# Altium schematic sheet Power.SchDoc: {Наименование}
size 420 x 297 mm; ApprovedBy: {Утвердил}; CheckedBy: {Проверил}; DrawnBy: {Разраб.}; DocumentNumber: НРДЦ.ХХХХХХ.ХХХ 00; SheetNumber: {}; SheetTotal: {}; Scale: {Мш.}; PageSetup: Record=PageOptions|CenterHorizontal=False|CenterVertical=False|PrintScale=0.95|XCorrection=0.00|YCorrection=0.00|PrintKind=1|BorderSize=5000000|LeftOffset=0|BottomOffset=0|Orientation=1|PaperLength=1000|PaperWidth=1000|Scale=100|PaperSource=15|PrintQuality=600|MediaType=1|DitherType=10|PaperKind=A4|PrintScaleMode=1; ProcessInspection: {Т.контр.}; Mass: {М.}; NormInspection: {Н.контр.}; Letter1Column: {}; Letter2Column: {}; Letter3Column: {}; DocumentType: {Документ}; Rule: PcbType=ProtelPcb
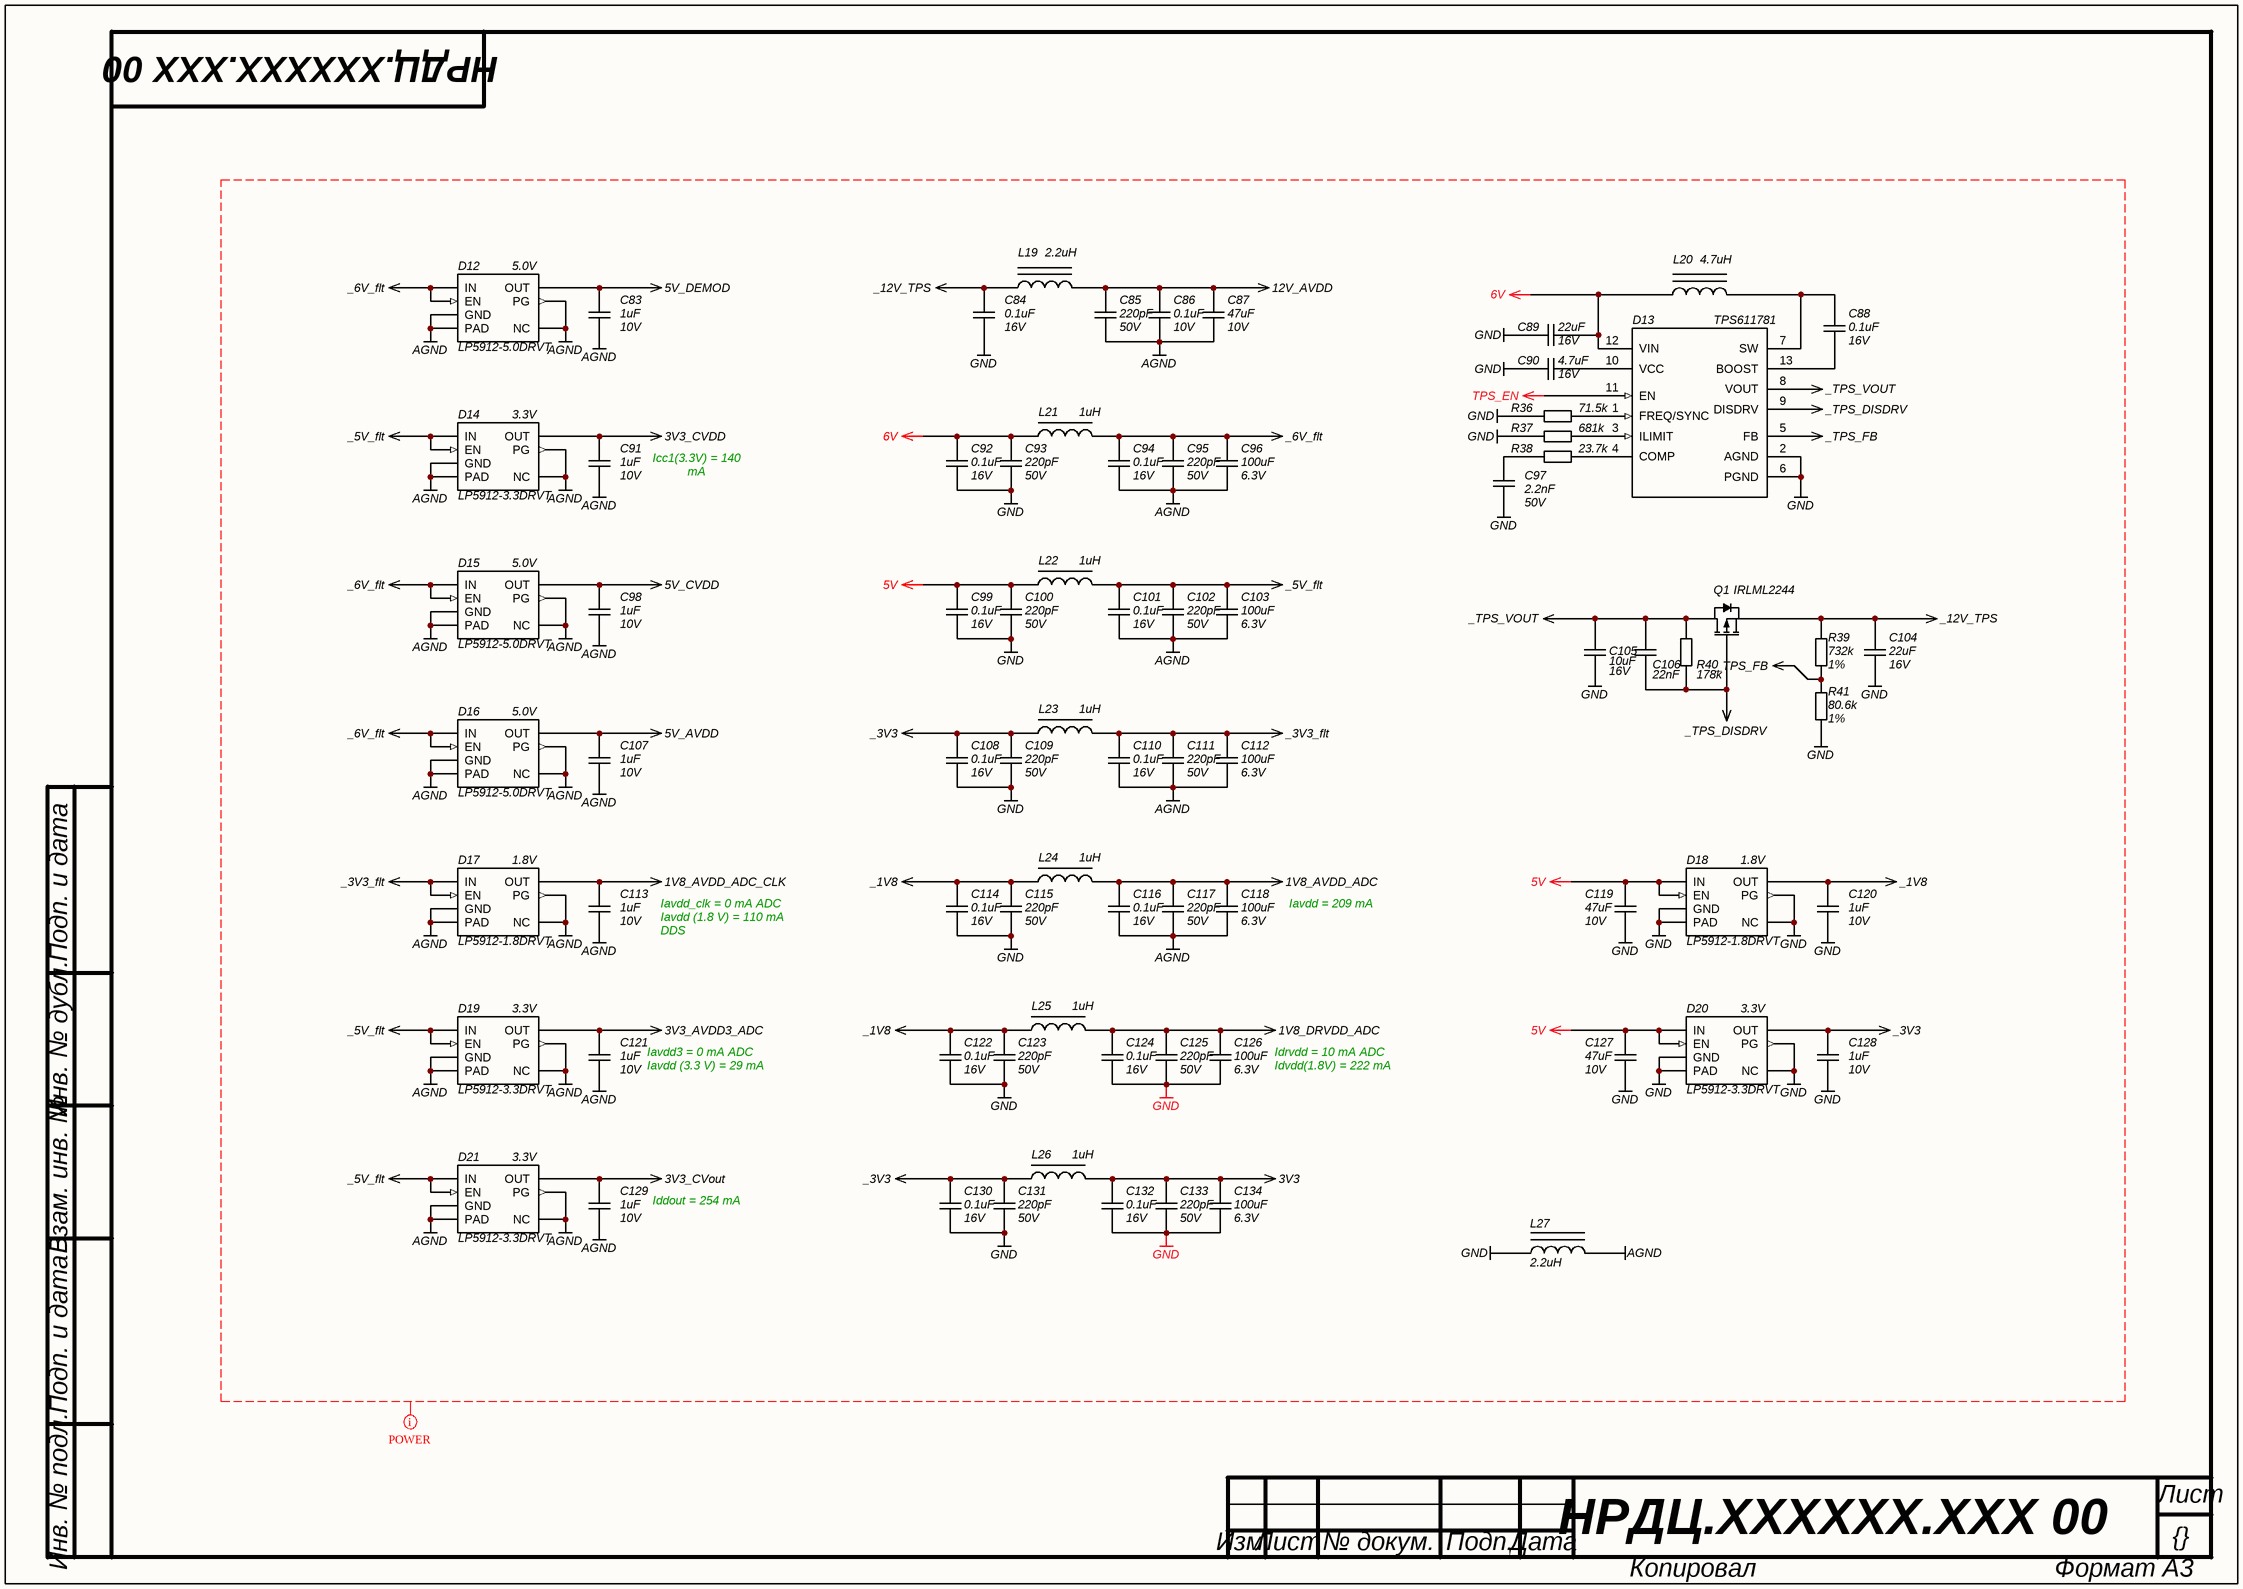
[diagram p0: Power.SchDoc]

## Parts
C83  value 1uF  Voltage: 10V  [C0805]  (hidden comment: CAP)
C84  value 0.1uF  Voltage: 16V  [C0402]  (hidden comment: CAP)
C85  value 220pF  Voltage: 50V  [C0603]  (hidden comment: CAP)
C86  value 0.1uF  Voltage: 10V  [C0402]  (hidden comment: CAP)
C87  value 47uF  Voltage: 10V  [C1210]  (hidden comment: CAP uF)
C88  value 0.1uF  Voltage: 16V  [C0402]  (hidden comment: CAP)
C89  value 22uF  Voltage: 16V  [C0805]  (hidden comment: CAP uF)
C90  value 4.7uF  Voltage: 16V  [C0603]  (hidden comment: CAP)
C91  value 1uF  Voltage: 10V  [C0805]  (hidden comment: CAP)
C92  value 0.1uF  Voltage: 16V  [C0603]  (hidden comment: CAP)
C93  value 220pF  Voltage: 50V  [C0603]  (hidden comment: CAP)
C94  value 0.1uF  Voltage: 16V  [C0603]  (hidden comment: CAP)
C95  value 220pF  Voltage: 50V  [C0603]  (hidden comment: CAP)
C96  value 100uF  Voltage: 6.3V  [C1210]  (hidden comment: CAP uF)
C97  value 2.2nF  Voltage: 50V  [C0603]  (hidden comment: CAP)
C98  value 1uF  Voltage: 10V  [C0805]  (hidden comment: CAP)
C99  value 0.1uF  Voltage: 16V  [C0603]  (hidden comment: CAP)
C100  value 220pF  Voltage: 50V  [C0603]  (hidden comment: CAP)
C101  value 0.1uF  Voltage: 16V  [C0603]  (hidden comment: CAP)
C102  value 220pF  Voltage: 50V  [C0603]  (hidden comment: CAP)
C103  value 100uF  Voltage: 6.3V  [C1210]  (hidden comment: CAP uF)
C104  value 22uF  Voltage: 16V  [C0805]  (hidden comment: CAP uF)
C105  value 10uF  Voltage: 16V  [C0805]  (hidden comment: CAP uF)
C106  value 22nF  [C0402]  (hidden comment: CAP)
C107  value 1uF  Voltage: 10V  [C0805]  (hidden comment: CAP)
C108  value 0.1uF  Voltage: 16V  [C0603]  (hidden comment: CAP)
C109  value 220pF  Voltage: 50V  [C0603]  (hidden comment: CAP)
C110  value 0.1uF  Voltage: 16V  [C0603]  (hidden comment: CAP)
C111  value 220pF  Voltage: 50V  [C0603]  (hidden comment: CAP)
C112  value 100uF  Voltage: 6.3V  [C1210]  (hidden comment: CAP uF)
C113  value 1uF  Voltage: 10V  [C0805]  (hidden comment: CAP)
C114  value 0.1uF  Voltage: 16V  [C0603]  (hidden comment: CAP)
C115  value 220pF  Voltage: 50V  [C0603]  (hidden comment: CAP)
C116  value 0.1uF  Voltage: 16V  [C0603]  (hidden comment: CAP)
C117  value 220pF  Voltage: 50V  [C0603]  (hidden comment: CAP)
C118  value 100uF  Voltage: 6.3V  [C1210]  (hidden comment: CAP uF)
C119  value 47uF  Voltage: 10V  [C1210]  (hidden comment: CAP uF)
C120  value 1uF  Voltage: 10V  [C0805]  (hidden comment: CAP)
C121  value 1uF  Voltage: 10V  [C0805]  (hidden comment: CAP)
C122  value 0.1uF  Voltage: 16V  [C0603]  (hidden comment: CAP)
C123  value 220pF  Voltage: 50V  [C0603]  (hidden comment: CAP)
C124  value 0.1uF  Voltage: 16V  [C0603]  (hidden comment: CAP)
C125  value 220pF  Voltage: 50V  [C0603]  (hidden comment: CAP)
C126  value 100uF  Voltage: 6.3V  [C1210]  (hidden comment: CAP uF)
C127  value 47uF  Voltage: 10V  [C1210]  (hidden comment: CAP uF)
C128  value 1uF  Voltage: 10V  [C0805]  (hidden comment: CAP)
C129  value 1uF  Voltage: 10V  [C0805]  (hidden comment: CAP)
C130  value 0.1uF  Voltage: 16V  [C0603]  (hidden comment: CAP)
C131  value 220pF  Voltage: 50V  [C0603]  (hidden comment: CAP)
C132  value 0.1uF  Voltage: 16V  [C0603]  (hidden comment: CAP)
C133  value 220pF  Voltage: 50V  [C0603]  (hidden comment: CAP)
C134  value 100uF  Voltage: 6.3V  [C1210]  (hidden comment: CAP uF)
D12  Name: LP5912-5.0DRVT  Voltage: 5.0V  [WSON-6]  (hidden comment: LP5912)
D13  TPS611781  [TPS611781x]
D14  Name: LP5912-3.3DRVT  Voltage: 3.3V  [WSON-6]  (hidden comment: LP5912)
D15  Name: LP5912-5.0DRVT  Voltage: 5.0V  [WSON-6]  (hidden comment: LP5912)
D16  Name: LP5912-5.0DRVT  Voltage: 5.0V  [WSON-6]  (hidden comment: LP5912)
D17  Name: LP5912-1.8DRVT  Voltage: 1.8V  [WSON-6]  (hidden comment: LP5912)
D18  Name: LP5912-1.8DRVT  Voltage: 1.8V  [WSON-6]  (hidden comment: LP5912)
D19  Name: LP5912-3.3DRVT  Voltage: 3.3V  [WSON-6]  (hidden comment: LP5912)
D20  Name: LP5912-3.3DRVT  Voltage: 3.3V  [WSON-6]  (hidden comment: LP5912)
D21  Name: LP5912-3.3DRVT  Voltage: 3.3V  [WSON-6]  (hidden comment: LP5912)
L19  value 2.2uH  [XAL4020]  (hidden comment: Inductor PWR)
L20  value 4.7uH  [XAL4030]  (hidden comment: Inductor PWR)
L21  value 1uH  [L1210_Murata LQH]  (hidden comment: Inductor LF)
L22  value 1uH  [L1210_Murata LQH]  (hidden comment: Inductor LF)
L23  value 1uH  [L1210_Murata LQH]  (hidden comment: Inductor LF)
L24  value 1uH  [L1210_Murata LQH]  (hidden comment: Inductor LF)
L25  value 1uH  [L1210_Murata LQH]  (hidden comment: Inductor LF)
L26  value 1uH  [L1210_Murata LQH]  (hidden comment: Inductor LF)
L27  value 2.2uH  [XAL4020]  (hidden comment: Inductor PWR)
Q1  IRLML2244  [SOT-23]
R36  value 71.5k  [R0402]  (hidden comment: RES)
R37  value 681k  [R0402]  (hidden comment: RES)
R38  value 23.7k  [R0603]  (hidden comment: RES)
R39  value 732k  Tolerance: 1%  [R0402]  (hidden comment: RES)
R40  value 178k  [R0402]  (hidden comment: RES)
R41  value 80.6k  Tolerance: 1%  [R0402]  (hidden comment: RES)

## Nets
1V8_AVDD_ADC: C116.2 C117.2 C118.2 L24.2
1V8_AVDD_ADC_CLK: C113.1 D17.1(OUT)
1V8_DRVDD_ADC: C124.2 C125.2 C126.2 L25.2
3V3: C132.2 C133.2 C134.2 L26.2
3V3_AVDD3_ADC: C121.1 D19.1(OUT)
3V3_CVDD: C91.1 D14.1(OUT)
3V3_CVout: C129.1 D21.1(OUT)
5V: C99.2 C100.2 C119.2 C127.2 D18.4(EN) D18.6(IN) D20.4(EN) D20.6(IN) L22.1
5V_AVDD: C107.1 D16.1(OUT)
5V_CVDD: C98.1 D15.1(OUT)
5V_DEMOD: C83.1 D12.1(OUT)
6V: C89.1 C92.2 C93.2 D13.12(VIN) L20.1 L21.1
12V_AVDD: C85.2 C86.2 C87.2 L19.2
_1V8: C114.2 C115.2 C120.1 C122.2 C123.2 D18.1(OUT) L24.1 L25.1
_3V3: C108.2 C109.2 C128.1 C130.2 C131.2 D20.1(OUT) L23.1 L26.1
_3V3_flt: C110.2 C111.2 C112.2 D17.4(EN) D17.6(IN) L23.2
_5V_flt: C101.2 C102.2 C103.2 D14.4(EN) D14.6(IN) D19.4(EN) D19.6(IN) D21.4(EN) D21.6(IN) L22.2
_6V_flt: C94.2 C95.2 C96.2 D12.4(EN) D12.6(IN) D15.4(EN) D15.6(IN) D16.4(EN) D16.6(IN) L21.2
_12V_TPS: C84.2 C104.2 L19.1 Q1.2(S) R39.2
_TPS_DISDRV: C106.2 D13.9(DISDRV) Q1.1(G) R40.1
_TPS_FB: D13.5(FB) R39.1 R41.2
_TPS_VOUT: C105.2 C106.1 D13.8(VOUT) Q1.3(D) R40.2
AGND: C83.2 C85.1 C86.1 C87.1 C91.2 C94.1 C95.1 C96.1 C98.2 C101.1 C102.1 C103.1 C107.2 C110.1 C111.1 C112.1 C113.2 C116.1 C117.1 C118.1 C121.2 C129.2 D12.0(PAD) D12.2(NC) D12.3(PG) D12.5(GND) D14.0(PAD) D14.2(NC) D14.3(PG) D14.5(GND) D15.0(PAD) D15.2(NC) D15.3(PG) D15.5(GND) D16.0(PAD) D16.2(NC) D16.3(PG) D16.5(GND) D17.0(PAD) D17.2(NC) D17.3(PG) D17.5(GND) D19.0(PAD) D19.2(NC) D19.3(PG) D19.5(GND) D21.0(PAD) D21.2(NC) D21.3(PG) D21.5(GND) L27.2
GND: C84.1 C89.2 C90.2 C92.1 C93.1 C97.1 C99.1 C100.1 C104.1 C105.1 C108.1 C109.1 C114.1 C115.1 C119.1 C120.2 C122.1 C123.1 C124.1 C125.1 C126.1 C127.1 C128.2 C130.1 C131.1 C132.1 C133.1 C134.1 D13.2(AGND) D13.6(PGND) D18.0(PAD) D18.2(NC) D18.3(PG) D18.5(GND) D20.0(PAD) D20.2(NC) D20.3(PG) D20.5(GND) L27.1 R36.1 R37.1 R41.1
TPS_EN: D13.11(EN)
NetC88_1: C88.1 D13.13(BOOST)
NetC88_2: C88.2 D13.7(SW) L20.2
NetC90_1: C90.1 D13.10(VCC)
NetC97_2: C97.2 R38.1
NetD13_1: D13.1(FREQ/SYNC) R36.2
NetD13_3: D13.3(ILIMIT) R37.2
NetD13_4: D13.4(COMP) R38.2

## Layout directives
net class POWER: 1V8_AVDD_ADC, 1V8_AVDD_ADC_CLK, 1V8_DRVDD_ADC, 3V3, 3V3_AVDD3_ADC, 3V3_CVDD, 3V3_CVout, 5V, 5V_AVDD, 5V_CVDD, 5V_DEMOD, 6V, 12V_AVDD, _1V8, _3V3, _3V3_flt, _5V_flt, _6V_flt, _12V_TPS, _TPS_DISDRV, _TPS_FB, _TPS_VOUT, AGND, GND, TPS_EN

## Notes on the sheet
- (near C91) Icc1(3.3V) = 140 mA
  Icc2(3.3V) = 130 mA
- Iavdd_clk = 0 mA ADC
  Iavdd (1.8 V) = 110 mA DDS
- Iavdd = 209 mA ADC
- (near C121) Iavdd3 = 0 mA ADC
  Iavdd (3.3 V) = 29 mA DDS
- Idrvdd = 10 mA ADC
  Idvdd(1.8V) = 222 mA DDS
- (near C129) Iddout = 254 mA
- Подп. и дата
- Инв. № дубл.
- Взам. инв. №
- Инв. № подл.
- Лист
- Изм.
- № докум.
- Подп.
- Дата
- Копировал
- Формат А3

## Library data of the parts
C83 C91 C98 C107 C113 C120 C121 C128 C129 = CAP: SMD Capacitor; Manufacturer: Murata; Material: X7R; Tolerance: 10%; Type: Ceramic Capacitor; P/N: GRM21BR71A105KA01K
C84 C88 = CAP: SMD Capacitor; Manufacturer: Murata; Material: X5R; Tolerance: ±10%; Type: Ceramic Capacitor; P/N: GRM155R61C104KA88D
C85 C93 C95 C100 C102 C109 C111 C115 C117 C123 C125 C131 C133 = CAP: SMD Capacitor; Manufacturer: Murata; Material: X7R; Tolerance: 10%; Type: Ceramic Capacitor; P/N: GRM188R71H221KA01D
C86 = CAP: SMD Capacitor; Manufacturer: Murata; Material: X7R; Tolerance: 10%; Type: Ceramic Capacitor; P/N: GRM155R71A104KA01J
C87 C119 C127 = CAP uF: SMD Capacitor; Manufacturer: Murata; Material: X7R; Tolerance: 10%; Type: Ceramic Capacitor; P/N: GRM32ER71A476KE15L
C89 C104 = CAP uF: SMD Capacitor; Manufacturer: Murata; Material: X5R; Tolerance: ±20%; Type: Ceramic Capacitor; P/N: GRM21BR61C226ME44L
C90 = CAP: SMD Capacitor; Manufacturer: Murata; Material: X5R; Tolerance: 10%; Type: Ceramic Capacitor; P/N: GRM188R61C475KAAJD
C92 C94 C99 C101 C108 C110 C114 C116 C122 C124 C130 C132 = CAP: SMD Capacitor; Manufacturer: Murata; Material: X7R; Tolerance: 10%; Type: Ceramic Capacitor; P/N: GRM188R71C104KA01D
C96 C103 C112 C118 C126 C134 = CAP uF: SMD Capacitor; Manufacturer: Murata; Material: X5R; Tolerance: 20%; Type: Ceramic Capacitor; P/N: GRM32ER60J107ME20L
C97 = CAP: SMD Capacitor; Manufacturer: Murata; Material: NP0; Tolerance: ±5%; Type: Ceramic Capacitor; P/N: GRM1885C1H222JA01D
C105 = CAP uF: SMD Capacitor; Manufacturer: Murata; Material: X5R; Tolerance: ±10%; Type: Ceramic Capacitor; P/N: GRM21BR61C106KE15K
C106 = CAP: SMD Capacitor; Manufacturer: Murata; Material: X7R; Tolerance: 10%; Voltage: 50V; Type: Ceramic Capacitor; P/N: GCM155R71H223KA55D
D12 D14-D21 = LP5912: LP5912 500-mA Low-Noise, Low-IQ LDO; Manufacturer: Texas Instruments; Type: Low-Noise LDO; Current: 500mA; Package: WSON; Temperature Range: –40°C to 125°C
  D12 D15 D16: P/N: LP5912-5.0DRVT; Supplier 1: Arrow Electronics; Supplier Part Number 1: LP5912-5.0DRVT
  D14 D19-D21: P/N: LP5912-3.3DRVT; Supplier 1: Digi-Key; Supplier Part Number 1: 296-44153-2-ND
  D17 D18: P/N: LP5912-1.8DRVT; Supplier 1: Digi-Key; Supplier Part Number 1: 296-44156-6-ND
D13 = TPS611781: 10-A Fully-Integrated Synchronous Boost with Load Disconnect Control; Manufacturer: Texas Instruments; Voltage: 4.5 V to 20 V; P/N: TPS611781RNW; Current: 10 A; Name: TPS611781; Package: 13-VQFN-HR (3.5x3.0); Temperature Range: –40°C to 125°C; Type: Synchronous Boost; Supplier 1: Digi-Key; Supplier Part Number 1: 296-46568-1-ND
L19 L27 = Inductor PWR: Magnetic-Core Inductor; Manufacturer: Coilcraft; Name: XEL4020-222MEB; Current: 5.9A; Tolerance: ±30%; Temperature Range: -40ºC to 125ºC
L20 = Inductor PWR: Magnetic-Core Inductor; Manufacturer: Coilcraft; Name: XEL4030-472MEB; Current: 5A; Tolerance: ±30%; Temperature Range: -40ºC to 125ºC
L21-L26 = Inductor LF: Inductor Power Lines; Manufacturer: Murata; Name: LQH32PN1R0NNC; Current: 2500mA; Tolerance: 5%; Frequency: 100MHz; Temperature Range: -25ºC to 85ºC; Series: LQH; P/N: LQH32PN1R0NNC
Q1 = IRLML2244: P-Channel MOSFET; Current: 4.3A; Channel Resistance: 54 mΩ; Power Dissipation: 1.3W; Voltage: -20V; Name: IRLML2244; Package: SOT-23; Type: P-Channel Mosfet
R36 = RES: SMD Resistor; Manufacturer: Panasonic Electronic Components; Name: Chip SMD Resistor; Power: 0.063 Wt; Tolerance: 1%; P/N: ERJ-2RKF7152X; Temperature Range: -55…155°C
R37 = RES: SMD Resistor; Manufacturer: Panasonic Electronic Components; Name: Chip SMD Resistor; Power: 0.063 Wt; Tolerance: 1%; P/N: ERJ-2RKF6813X; Temperature Range: -55…155°C
R38 = RES: SMD Resistor; Manufacturer: Panasonic Electronic Components; Name: Chip SMD Resistor; Power: 0.1 Wt; Tolerance: 1%; P/N: ERJ-3EKF2372V; Temperature Range: -55…155°C
R39 = RES: SMD Resistor; Manufacturer: Panasonic Electronic Components; Name: Chip SMD Resistor; Power: 0.063 Wt; P/N: ERJ-2RKF7323X; Temperature Range: -55…155°C
R40 = RES: SMD Resistor; Manufacturer: Panasonic Electronic Components; Name: Chip SMD Resistor; Power: 0.063 Wt; Tolerance: 1%; P/N: ERJ-2RKF1783X; Temperature Range: -55…155°C
R41 = RES: SMD Resistor; Manufacturer: Panasonic Electronic Components; Name: Chip SMD Resistor; Power: 0.063 Wt; P/N: ERJ-2RKF8062X; Temperature Range: -55…155°C